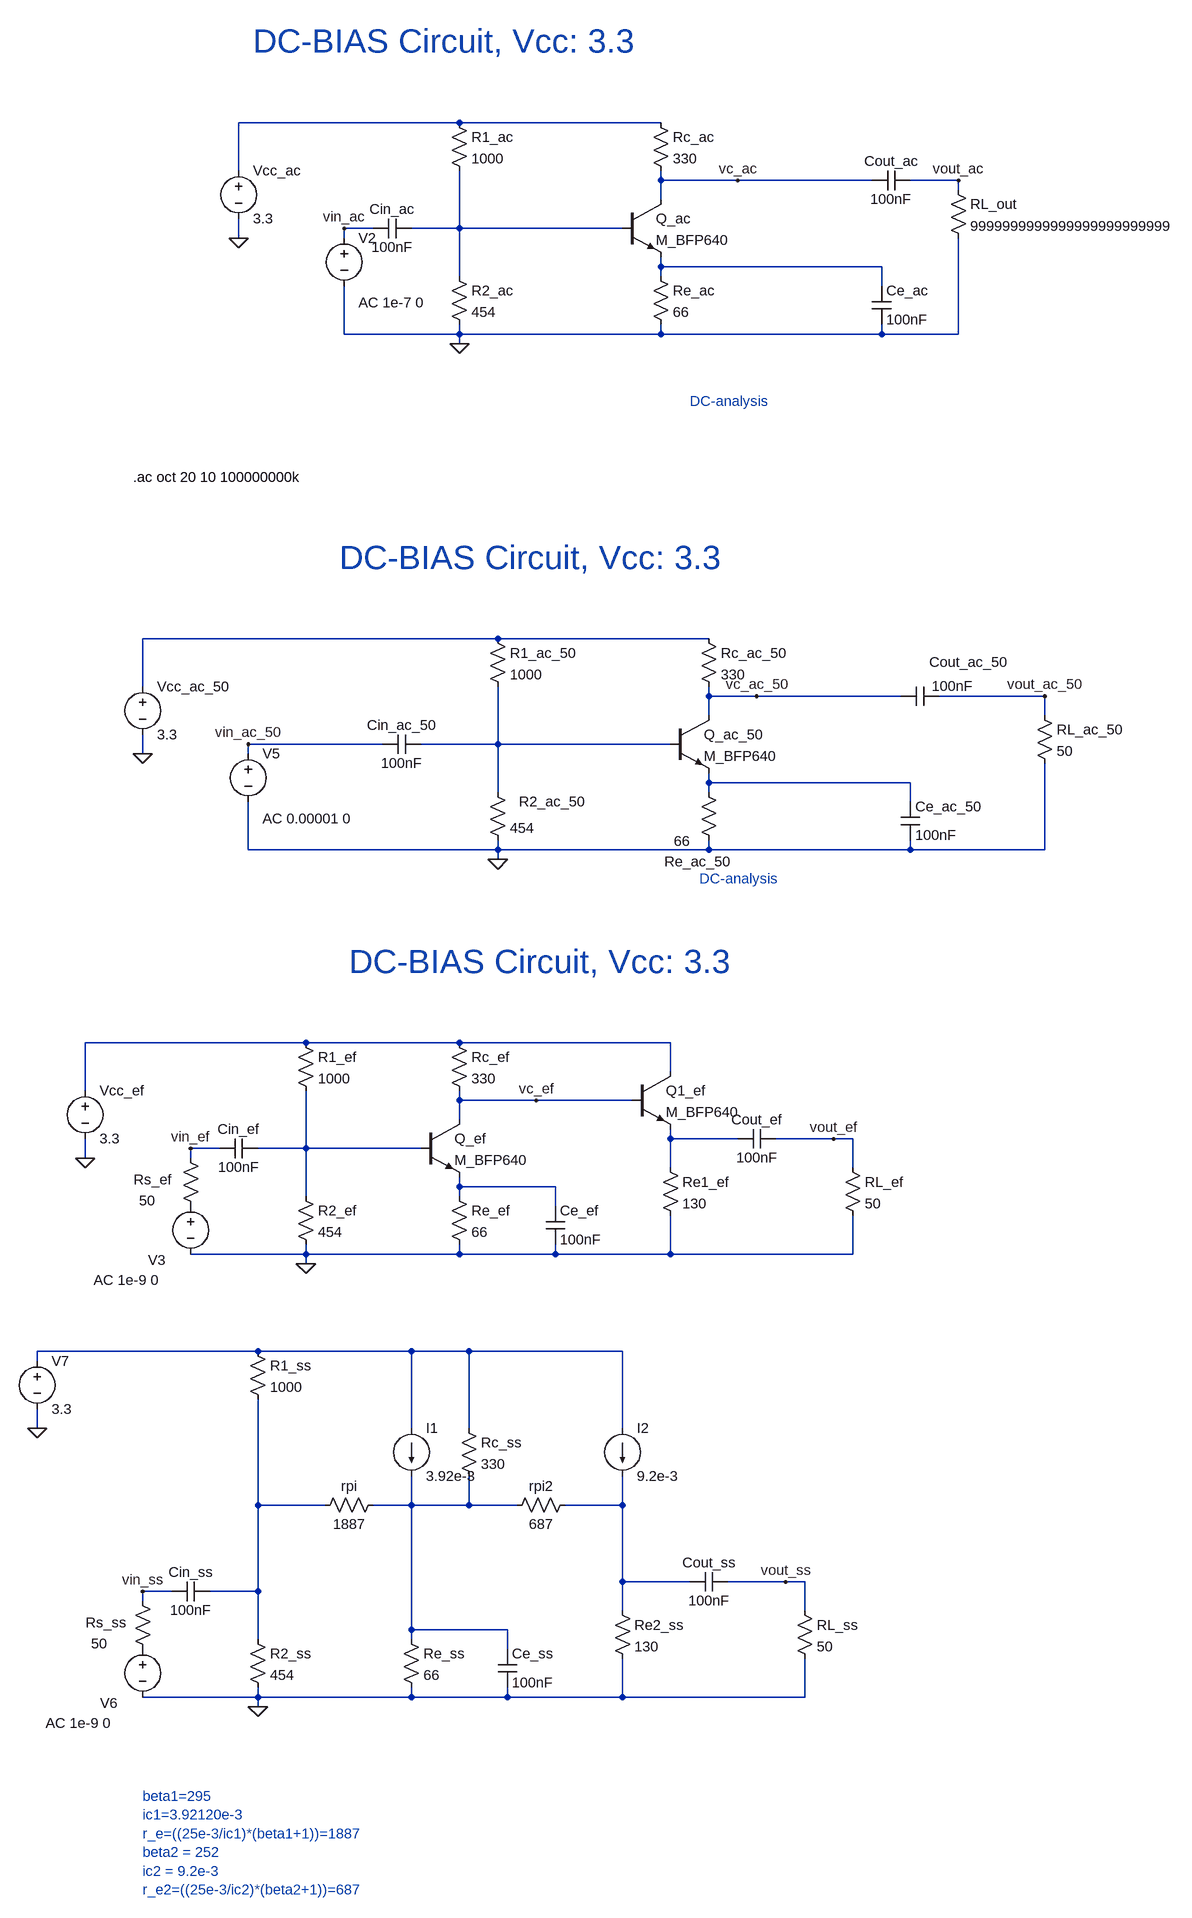
[diagram p0: schematic BP640_FREQ_3V.asc]
BP640_FREQ_3V.asc, the LTspice schematic file:
Version 4
SHEET 1 2084 3892
WIRE -2048 -608 -2416 -608
WIRE -1712 -608 -2048 -608
WIRE -2416 -528 -2416 -608
WIRE -1712 -512 -1712 -528
WIRE -1584 -512 -1712 -512
WIRE -1360 -512 -1584 -512
WIRE -1216 -512 -1296 -512
WIRE -1216 -496 -1216 -512
WIRE -1712 -480 -1712 -512
WIRE -2192 -432 -2240 -432
WIRE -2048 -432 -2048 -528
WIRE -2048 -432 -2128 -432
WIRE -1776 -432 -2048 -432
WIRE -2416 -416 -2416 -448
WIRE -2240 -416 -2240 -432
WIRE -1712 -368 -1712 -384
WIRE -1344 -368 -1712 -368
WIRE -2048 -352 -2048 -432
WIRE -1712 -352 -1712 -368
WIRE -1344 -336 -1344 -368
WIRE -2240 -256 -2240 -336
WIRE -2048 -256 -2048 -272
WIRE -2048 -256 -2240 -256
WIRE -1712 -256 -1712 -272
WIRE -1712 -256 -2048 -256
WIRE -1344 -256 -1344 -272
WIRE -1344 -256 -1712 -256
WIRE -1216 -256 -1216 -416
WIRE -1216 -256 -1344 -256
WIRE -2048 -240 -2048 -256
WIRE -1984 720 -2576 720
WIRE -1632 720 -1984 720
WIRE -2576 800 -2576 720
WIRE -1632 816 -1632 800
WIRE -1552 816 -1632 816
WIRE -1312 816 -1552 816
WIRE -1072 816 -1248 816
WIRE -1632 848 -1632 816
WIRE -1072 848 -1072 816
WIRE -2176 896 -2400 896
WIRE -1984 896 -1984 800
WIRE -1984 896 -2112 896
WIRE -1696 896 -1984 896
WIRE -2576 912 -2576 880
WIRE -2400 912 -2400 896
WIRE -1632 960 -1632 944
WIRE -1296 960 -1632 960
WIRE -1984 976 -1984 896
WIRE -1632 976 -1632 960
WIRE -1296 992 -1296 960
WIRE -2400 1072 -2400 992
WIRE -1984 1072 -1984 1056
WIRE -1984 1072 -2400 1072
WIRE -1632 1072 -1632 1056
WIRE -1632 1072 -1984 1072
WIRE -1296 1072 -1296 1056
WIRE -1296 1072 -1632 1072
WIRE -1072 1072 -1072 928
WIRE -1072 1072 -1296 1072
WIRE -1984 1088 -1984 1072
WIRE -2304 1792 -2672 1792
WIRE -2048 1792 -2304 1792
WIRE -1696 1792 -2048 1792
WIRE -1696 1840 -1696 1792
WIRE -2672 1872 -2672 1792
WIRE -2048 1888 -2048 1872
WIRE -1920 1888 -2048 1888
WIRE -1760 1888 -1920 1888
WIRE -2048 1920 -2048 1888
WIRE -1696 1952 -1696 1936
WIRE -1584 1952 -1696 1952
WIRE -1424 1952 -1520 1952
WIRE -1392 1952 -1424 1952
WIRE -2448 1968 -2496 1968
WIRE -2304 1968 -2304 1872
WIRE -2304 1968 -2384 1968
WIRE -2112 1968 -2304 1968
WIRE -2672 1984 -2672 1952
WIRE -2496 1984 -2496 1968
WIRE -1696 2000 -1696 1952
WIRE -1392 2000 -1392 1952
WIRE -2048 2032 -2048 2016
WIRE -1888 2032 -2048 2032
WIRE -2304 2048 -2304 1968
WIRE -2048 2048 -2048 2032
WIRE -1888 2064 -1888 2032
WIRE -2304 2144 -2304 2128
WIRE -2304 2144 -2496 2144
WIRE -2048 2144 -2048 2128
WIRE -2048 2144 -2304 2144
WIRE -1888 2144 -1888 2128
WIRE -1888 2144 -2048 2144
WIRE -1696 2144 -1696 2080
WIRE -1696 2144 -1888 2144
WIRE -1392 2144 -1392 2080
WIRE -1392 2144 -1696 2144
WIRE -2304 2160 -2304 2144
WIRE -2384 2928 -2752 2928
WIRE -2128 2928 -2384 2928
WIRE -2032 2928 -2128 2928
WIRE -1776 2928 -2032 2928
WIRE -2752 2944 -2752 2928
WIRE -2752 3056 -2752 3024
WIRE -2128 3056 -2128 2928
WIRE -2032 3056 -2032 2928
WIRE -1776 3056 -1776 2928
WIRE -2384 3184 -2384 3008
WIRE -2272 3184 -2384 3184
WIRE -2128 3184 -2128 3136
WIRE -2128 3184 -2192 3184
WIRE -2032 3184 -2032 3136
WIRE -2032 3184 -2128 3184
WIRE -1952 3184 -2032 3184
WIRE -1776 3184 -1776 3136
WIRE -1776 3184 -1872 3184
WIRE -1776 3312 -1776 3184
WIRE -1664 3312 -1776 3312
WIRE -1504 3312 -1600 3312
WIRE -1472 3312 -1504 3312
WIRE -2528 3328 -2576 3328
WIRE -2384 3328 -2384 3184
WIRE -2384 3328 -2464 3328
WIRE -2576 3344 -2576 3328
WIRE -1776 3360 -1776 3312
WIRE -1472 3360 -1472 3312
WIRE -2128 3392 -2128 3184
WIRE -1968 3392 -2128 3392
WIRE -2384 3408 -2384 3328
WIRE -2128 3408 -2128 3392
WIRE -1968 3424 -1968 3392
WIRE -2384 3504 -2384 3488
WIRE -2384 3504 -2576 3504
WIRE -2128 3504 -2128 3488
WIRE -2128 3504 -2384 3504
WIRE -1968 3504 -1968 3488
WIRE -1968 3504 -2128 3504
WIRE -1776 3504 -1776 3440
WIRE -1776 3504 -1968 3504
WIRE -1472 3504 -1472 3440
WIRE -1472 3504 -1776 3504
WIRE -2384 3520 -2384 3504
FLAG -2416 -416 0
FLAG -2048 -240 0
FLAG -2576 912 0
FLAG -1984 1088 0
FLAG -2400 896 vin_ac_50
FLAG -1072 816 vout_ac_50
FLAG -2240 -432 vin_ac
FLAG -1216 -512 vout_ac
FLAG -1584 -512 vc_ac
FLAG -1552 816 vc_ac_50
FLAG -2672 1984 0
FLAG -2304 2160 0
FLAG -2496 1968 vin_ef
FLAG -1920 1888 vc_ef
FLAG -1424 1952 vout_ef
FLAG -2752 3056 0
FLAG -2384 3520 0
FLAG -2576 3328 vin_ss
FLAG -1504 3312 vout_ss
DATAFLAG -1632 816 ""
DATAFLAG -1632 832 ""
DATAFLAG -1232 -512 ""
SYMBOL voltage -2240 -432 R0
WINDOW 123 24 124 Left 2
WINDOW 39 0 0 Left 0
SYMATTR Value2 AC 1e-7 0
SYMATTR InstName V2
SYMATTR Value ""
SYMBOL voltage -2416 -544 R0
WINDOW 123 0 0 Left 0
WINDOW 39 0 0 Left 0
SYMATTR InstName Vcc_ac
SYMATTR Value 3.3
SYMBOL npn -1776 -480 R0
SYMATTR InstName Q_ac
SYMATTR Value M_BFP640
SYMBOL res -2064 -624 R0
SYMATTR InstName R1_ac
SYMATTR Value 1000
SYMBOL res -2064 -368 R0
SYMATTR InstName R2_ac
SYMATTR Value 454
SYMBOL res -1728 -368 R0
SYMATTR InstName Re_ac
SYMATTR Value 66
SYMBOL res -1728 -624 R0
SYMATTR InstName Rc_ac
SYMATTR Value 330
SYMBOL res -1232 -512 R0
SYMATTR InstName RL_out
SYMATTR Value 9999999999999999999999999
SYMBOL cap -1360 -336 R0
SYMATTR InstName Ce_ac
SYMATTR Value 100nF
SYMBOL cap -1296 -528 R90
WINDOW 0 0 32 VBottom 2
WINDOW 3 32 32 VTop 2
SYMATTR InstName Cout_ac
SYMATTR Value 100nF
SYMBOL cap -2128 -448 R90
WINDOW 0 0 32 VBottom 2
WINDOW 3 32 32 VTop 2
SYMATTR InstName Cin_ac
SYMATTR Value 100nF
SYMBOL voltage -2576 784 R0
WINDOW 123 0 0 Left 0
WINDOW 39 0 0 Left 0
SYMATTR InstName Vcc_ac_50
SYMATTR Value 3.3
SYMBOL npn -1696 848 R0
SYMATTR InstName Q_ac_50
SYMATTR Value M_BFP640
SYMBOL res -2000 704 R0
SYMATTR InstName R1_ac_50
SYMATTR Value 1000
SYMBOL res -2000 960 R0
WINDOW 0 51 32 Left 2
SYMATTR InstName R2_ac_50
SYMATTR Value 454
SYMBOL res -1648 960 R0
WINDOW 0 -58 132 Left 2
WINDOW 3 -42 98 Left 2
SYMATTR InstName Re_ac_50
SYMATTR Value 66
SYMBOL res -1648 704 R0
SYMATTR InstName Rc_ac_50
SYMATTR Value 330
SYMBOL res -1088 832 R0
SYMATTR InstName RL_ac_50
SYMATTR Value 50
SYMBOL cap -1312 992 R0
SYMATTR InstName Ce_ac_50
SYMATTR Value 100nF
SYMBOL cap -1248 800 R90
WINDOW 0 -25 -49 VBottom 2
WINDOW 3 -16 -22 VTop 2
SYMATTR InstName Cout_ac_50
SYMATTR Value 100nF
SYMBOL cap -2112 880 R90
WINDOW 0 0 32 VBottom 2
WINDOW 3 32 32 VTop 2
SYMATTR InstName Cin_ac_50
SYMATTR Value 100nF
SYMBOL voltage -2400 896 R0
WINDOW 123 24 124 Left 2
WINDOW 39 0 0 Left 0
SYMATTR Value2 AC 0.00001 0
SYMATTR InstName V5
SYMATTR Value ""
SYMBOL voltage -2672 1856 R0
WINDOW 123 0 0 Left 0
WINDOW 39 0 0 Left 0
SYMATTR InstName Vcc_ef
SYMATTR Value 3.3
SYMBOL npn -2112 1920 R0
SYMATTR InstName Q_ef
SYMATTR Value M_BFP640
SYMBOL res -2320 1776 R0
SYMATTR InstName R1_ef
SYMATTR Value 1000
SYMBOL res -2320 2032 R0
SYMATTR InstName R2_ef
SYMATTR Value 454
SYMBOL res -2064 2032 R0
SYMATTR InstName Re_ef
SYMATTR Value 66
SYMBOL res -2064 1776 R0
SYMATTR InstName Rc_ef
SYMATTR Value 330
SYMBOL cap -1904 2064 R0
SYMATTR InstName Ce_ef
SYMATTR Value 100nF
SYMBOL cap -2384 1952 R90
WINDOW 0 0 32 VBottom 2
WINDOW 3 32 32 VTop 2
SYMATTR InstName Cin_ef
SYMATTR Value 100nF
SYMBOL npn -1760 1840 R0
SYMATTR InstName Q1_ef
SYMATTR Value M_BFP640
SYMBOL res -1712 1984 R0
SYMATTR InstName Re1_ef
SYMATTR Value 130
SYMBOL voltage -2496 2048 R0
WINDOW 123 -162 140 Left 2
WINDOW 39 0 0 Left 0
WINDOW 0 -71 106 Left 2
SYMATTR Value2 AC 1e-9 0
SYMATTR InstName V3
SYMATTR Value ""
SYMBOL cap -1520 1936 R90
WINDOW 0 0 32 VBottom 2
WINDOW 3 32 32 VTop 2
SYMATTR InstName Cout_ef
SYMATTR Value 100nF
SYMBOL res -1408 1984 R0
SYMATTR InstName RL_ef
SYMATTR Value 50
SYMBOL res -2512 1968 R0
WINDOW 0 -79 52 Left 2
WINDOW 3 -70 87 Left 2
SYMATTR InstName Rs_ef
SYMATTR Value 50
SYMBOL res -2400 2912 R0
SYMATTR InstName R1_ss
SYMATTR Value 1000
SYMBOL res -2400 3392 R0
SYMATTR InstName R2_ss
SYMATTR Value 454
SYMBOL res -2144 3392 R0
SYMATTR InstName Re_ss
SYMATTR Value 66
SYMBOL res -2048 3040 R0
SYMATTR InstName Rc_ss
SYMATTR Value 330
SYMBOL cap -1984 3424 R0
SYMATTR InstName Ce_ss
SYMATTR Value 100nF
SYMBOL cap -2464 3312 R90
WINDOW 0 0 32 VBottom 2
WINDOW 3 32 32 VTop 2
SYMATTR InstName Cin_ss
SYMATTR Value 100nF
SYMBOL res -1792 3344 R0
SYMATTR InstName Re2_ss
SYMATTR Value 130
SYMBOL voltage -2576 3408 R0
WINDOW 123 -162 140 Left 2
WINDOW 39 0 0 Left 0
WINDOW 0 -71 106 Left 2
SYMATTR Value2 AC 1e-9 0
SYMATTR InstName V6
SYMATTR Value ""
SYMBOL cap -1600 3296 R90
WINDOW 0 0 32 VBottom 2
WINDOW 3 32 32 VTop 2
SYMATTR InstName Cout_ss
SYMATTR Value 100nF
SYMBOL res -1488 3344 R0
SYMATTR InstName RL_ss
SYMATTR Value 50
SYMBOL res -2592 3328 R0
WINDOW 0 -79 52 Left 2
WINDOW 3 -70 87 Left 2
SYMATTR InstName Rs_ss
SYMATTR Value 50
SYMBOL voltage -2752 2928 R0
WINDOW 123 0 0 Left 0
WINDOW 39 0 0 Left 0
SYMATTR InstName V7
SYMATTR Value 3.3
SYMBOL res -2176 3168 R90
WINDOW 0 0 56 VBottom 2
WINDOW 3 32 56 VTop 2
SYMATTR InstName rpi
SYMATTR Value 1887
SYMBOL current -2128 3056 R0
WINDOW 123 0 0 Left 0
WINDOW 39 0 0 Left 0
SYMATTR InstName I1
SYMATTR Value 3.92e-3
SYMBOL res -1856 3168 R90
WINDOW 0 0 56 VBottom 2
WINDOW 3 32 56 VTop 2
SYMATTR InstName rpi2
SYMATTR Value 687
SYMBOL current -1776 3056 R0
WINDOW 123 0 0 Left 0
WINDOW 39 0 0 Left 0
SYMATTR InstName I2
SYMATTR Value 9.2e-3
TEXT -1664 -144 Left 2 ;DC-analysis
TEXT -2392 -936 Left 5 ;DC-BIAS Circuit, Vcc: 3.3
TEXT -1648 1120 Left 2 ;DC-analysis
TEXT -2248 440 Left 5 ;DC-BIAS Circuit, Vcc: 3.3
TEXT -2592 224 Left 2 !.ac oct 20 10 100000000k
TEXT -2232 1520 Left 5 ;DC-BIAS Circuit, Vcc: 3.3
TEXT -2576 3736 Left 2 ;beta1=295 \nic1=3.92120e-3 \nr_e=((25e-3/ic1)*(beta1+1))=1887\nbeta2 = 252\nic2 = 9.2e-3\nr_e2=((25e-3/ic2)*(beta2+1))=687

The netlist it stands for:
* BP640_FREQ_3V.asc
V2 vin_ac 0 AC 1e-7 0
Vcc_ac N001 0 3.3
Q_ac vc_ac N002 N003 0 M_BFP640
R1_ac N001 N002 1000
R2_ac N002 0 454
Re_ac N003 0 66
Rc_ac N001 vc_ac 330
RL_out vout_ac 0 9999999999999999999999999
Ce_ac N003 0 100nF
Cout_ac vout_ac vc_ac 100nF
Cin_ac N002 vin_ac 100nF
Vcc_ac_50 N004 0 3.3
Q_ac_50 vc_ac_50 N005 N006 0 M_BFP640
R1_ac_50 N004 N005 1000
R2_ac_50 N005 0 454
Re_ac_50 N006 0 66
Rc_ac_50 N004 vc_ac_50 330
RL_ac_50 vout_ac_50 0 50
Ce_ac_50 N006 0 100nF
Cout_ac_50 vout_ac_50 vc_ac_50 100nF
Cin_ac_50 N005 vin_ac_50 100nF
V5 vin_ac_50 0 AC 0.00001 0
Vcc_ef N007 0 3.3
Q_ef vc_ef N009 N010 0 M_BFP640
R1_ef N007 N009 1000
R2_ef N009 0 454
Re_ef N010 0 66
Rc_ef N007 vc_ef 330
Ce_ef N010 0 100nF
Cin_ef N009 vin_ef 100nF
Q1_ef N007 vc_ef N008 0 M_BFP640
Re1_ef N008 0 130
V3 P001 0 AC 1e-9 0
Cout_ef vout_ef N008 100nF
RL_ef vout_ef 0 50
Rs_ef vin_ef P001 50
R1_ss N011 N012 1000
R2_ss N012 0 454
Re_ss N013 0 66
Rc_ss N011 N013 330
Ce_ss N013 0 100nF
Cin_ss N012 vin_ss 100nF
Re2_ss N014 0 130
V6 P002 0 AC 1e-9 0
Cout_ss vout_ss N014 100nF
RL_ss vout_ss 0 50
Rs_ss vin_ss P002 50
V7 N011 0 3.3
rpi N013 N012 1887
I1 N011 N013 3.92e-3
rpi2 N014 N013 687
I2 N011 N014 9.2e-3
.model NPN NPN
.model PNP PNP
.lib standard.bjt
* DC-analysis
* DC-BIAS Circuit, Vcc: 3.3
* DC-analysis
* DC-BIAS Circuit, Vcc: 3.3
.ac oct 20 10 100000000k
* DC-BIAS Circuit, Vcc: 3.3
* beta1=295
* ic1=3.92120e-3
* r_e=((25e-3/ic1)*(beta1+1))=1887
* beta2 = 252
* ic2 = 9.2e-3
* r_e2=((25e-3/ic2)*(beta2+1))=687
.backanno
.end